# EAGLE design ControlBoard (EAGLE 8.3.2)
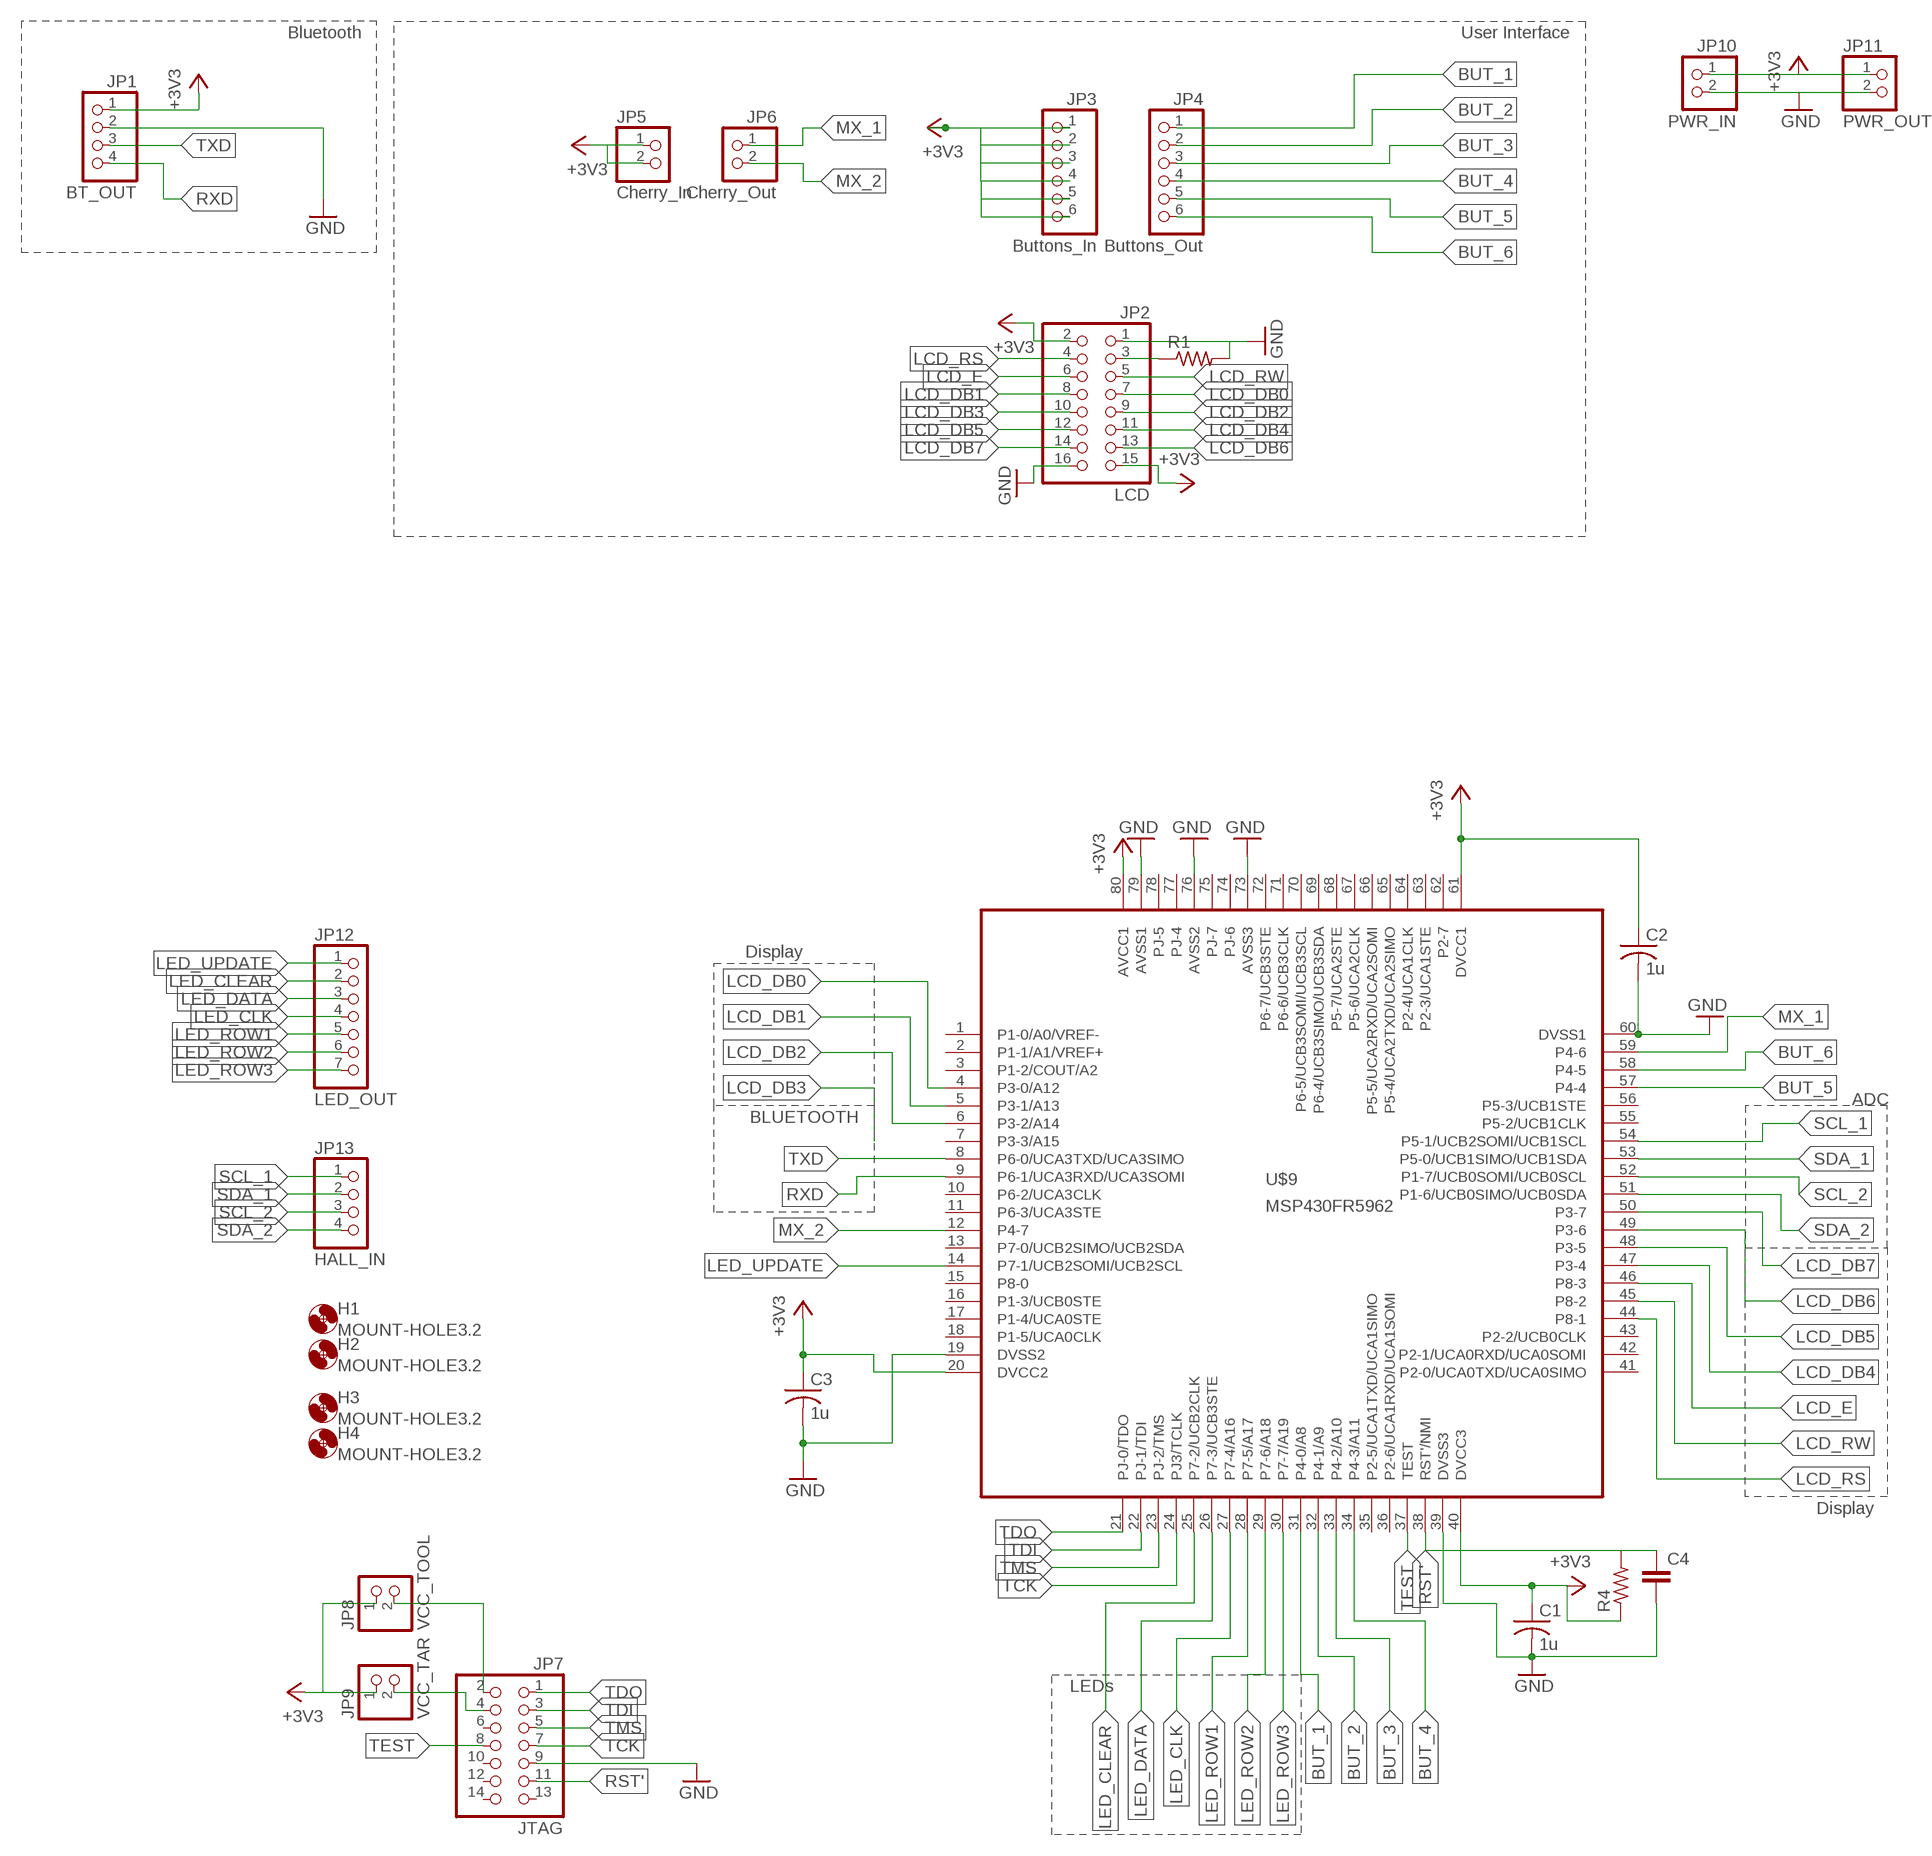
[diagram p0: schematic, sheet 1]

## Parts
C1  1u  C-USC0603  [C0603]
C2  1u  C-USC0603  [C0603]
C3  1u  C-USC0603  [C0603]
C4  C-EU025-025X050  [C025-025X050]
H1  MOUNT-HOLE3.2  [3,2]
H2  MOUNT-HOLE3.2  [3,2]
H3  MOUNT-HOLE3.2  [3,2]
H4  MOUNT-HOLE3.2  [3,2]
JP1  BT_OUT  PINHD-1X4  [1X04]
JP2  LCD  PINHD-2X8  [2X08]
JP3  Buttons_In  PINHD-1X6  [1X06]
JP4  Buttons_Out  PINHD-1X6  [1X06]
JP5  Cherry_In  PINHD-1X2  [1X02]
JP6  Cherry_Out  PINHD-1X2  [1X02]
JP7  JTAG  PINHD-2X7  [2X07]
JP8  VCC_TOOL  PINHD-1X2  [1X02]
JP9  VCC_TAR  PINHD-1X2  [1X02]
JP10  PWR_IN  PINHD-1X2  [1X02]
JP11  PWR_OUT  PINHD-1X2  [1X02]
JP12  LED_OUT  PINHD-1X7  [1X07]
JP13  HALL_IN  PINHD-1X4  [1X04]
R1  R-US_VMTA55  [VMTA55]
R4  R-US_VMTA55  [VMTA55]
U$9  MSP430FR5962  [LQFP80]

## Nets
+3V3: C1.1 C2.1 C3.1 JP1.1 JP2.2 JP2.15 JP3.1 JP3.2 JP3.3 JP3.4 JP3.5 JP3.6 JP5.1 JP5.2 JP8.1 JP9.1 JP10.1 JP11.1 R4.1 U$9.20(DVCC2) U$9.40(DVCC3) U$9.61(DVCC1) U$9.80(AVCC1)
BUT_1: JP4.1 U$9.31(P4-0/A8)
BUT_2: JP4.2 U$9.32(P4-1/A9)
BUT_3: JP4.3 U$9.33(P4-2/A10)
BUT_4: JP4.4 U$9.34(P4-3/A11)
BUT_5: JP4.5 U$9.57(P4-4)
BUT_6: JP4.6 U$9.58(P4-5)
GND: C1.2 C2.2 C3.2 C4.2 JP1.2 JP2.1 JP2.16 JP7.9 JP10.2 JP11.2 R1.2 U$9.19(DVSS2) U$9.39(DVSS3) U$9.60(DVSS1) U$9.73(AVSS3) U$9.76(AVSS2) U$9.79(AVSS1)
LCD_DB0: JP2.7 U$9.4(P3-0/A12)
LCD_DB1: JP2.8 U$9.5(P3-1/A13)
LCD_DB2: JP2.9 U$9.6(P3-2/A14)
LCD_DB3: JP2.10
LCD_DB4: JP2.11 U$9.47(P3-4)
LCD_DB5: JP2.12 U$9.48(P3-5)
LCD_DB6: JP2.13 U$9.49(P3-6)
LCD_DB7: JP2.14 U$9.50(P3-7)
LCD_E: JP2.6 U$9.46(P8-3)
LCD_RS: JP2.4 U$9.44(P8-1)
LCD_RW: JP2.5 U$9.45(P8-2)
LED_CLEAR: JP12.2 U$9.25(P7-2/UCB2CLK)
LED_CLK: JP12.4 U$9.27(P7-4/A16)
LED_DATA: JP12.3 U$9.26(P7-3/UCB3STE)
LED_ROW1: JP12.5 U$9.28(P7-5/A17)
LED_ROW2: JP12.6 U$9.29(P7-6/A18)
LED_ROW3: JP12.7 U$9.30(P7-7/A19)
LED_UPDATE: JP12.1 U$9.14(P7-1/UCB2SOMI/UCB2SCL)
MX_1: JP6.1 U$9.59(P4-6)
MX_2: JP6.2 U$9.12(P4-7)
N$3: JP2.3 R1.1
N$9: JP7.2 JP8.2
N$10: JP7.4 JP9.2
RST': C4.1 JP7.11 R4.2 U$9.38(RST'/NMI)
RXD: JP1.4 U$9.9(P6-1/UCA3RXD/UCA3SOMI)
SCL_1: JP13.1 U$9.54(P5-1/UCB2SOMI/UCB1SCL)
SCL_2: JP13.3 U$9.52(P1-7/UCB0SOMI/UCB0SCL)
SDA_1: JP13.2 U$9.53(P5-0/UCB1SIMO/UCB1SDA)
SDA_2: JP13.4 U$9.51(P1-6/UCB0SIMO/UCB0SDA)
TCK: JP7.7 U$9.24(PJ3/TCLK)
TDI: JP7.3 U$9.22(PJ-1/TDI)
TDO: JP7.1 U$9.21(PJ-0/TDO)
TEST: JP7.8 U$9.37(TEST)
TMS: JP7.5 U$9.23(PJ-2/TMS)
TXD: JP1.3 U$9.8(P6-0/UCA3TXD/UCA3SIMO)
Unconnected: JP7.6 JP7.10 JP7.12 JP7.13 JP7.14 U$9.2(P1-1/A1/VREF+) U$9.3(P1-2/COUT/A2) U$9.7(P3-3/A15) U$9.10(P6-2/UCA3CLK) U$9.11(P6-3/UCA3STE) U$9.13(P7-0/UCB2SIMO/UCB2SDA) U$9.15(P8-0) U$9.16(P1-3/UCB0STE) U$9.17(P1-4/UCA0STE) U$9.18(P1-5/UCA0CLK) U$9.35(P2-5/UCA1TXD/UCA1SIMO) U$9.36(P2-6/UCA1RXD/UCA1SOMI) U$9.41(P2-0/UCA0TXD/UCA0SIMO) U$9.42(P2-1/UCA0RXD/UCA0SOMI) U$9.43(P2-2/UCB0CLK) U$9.55(P5-2/UCB1CLK) U$9.56(P5-3/UCB1STE) U$9.62(P2-7) U$9.63(P2-3/UCA1STE) U$9.64(P2-4/UCA1CLK) U$9.65(P5-4/UCA2TXD/UCA2SIMO) U$9.66(P5-5/UCA2RXD/UCA2SOMI) U$9.67(P5-6/UCA2CLK) U$9.68(P5-7/UCA2STE) U$9.69(P6-4/UCB3SIMO/UCB3SDA) U$9.70(P6-5/UCB3SOMI/UCB3SCL) U$9.71(P6-6/UCB3CLK) U$9.72(P6-7/UCB3STE) U$9.74(PJ-6) U$9.75(PJ-7) U$9.77(PJ-4)

## Notes on the sheet
- Bluetooth | User Interface
- Display
- ADC
- BLUETOOTH
- Display
- LEDs

## Power pins joined to a net without a drawn wire
P1-0/A0/VREF-: U$9.1(P1-0/A0/VREF-)
PJ-5: U$9.78(PJ-5)

## Library data of the parts
C1-C3 = rcl:C-US: CAPACITOR, American symbol
C4 = rcl:C-EU: CAPACITOR, European symbol
H1-H4 = holes:MOUNT-HOLE: MOUNTING HOLE with drill center marker
JP1 JP13 = pinhead:PINHD-1X4: PIN HEADER
JP2 = pinhead:PINHD-2X8: PIN HEADER
JP3 JP4 = pinhead:PINHD-1X6: PIN HEADER
JP5 JP6 JP8-JP11 = pinhead:PINHD-1X2: PIN HEADER
JP7 = pinhead:PINHD-2X7: PIN HEADER
JP12 = pinhead:PINHD-1X7: PIN HEADER
R1 R4 = rcl:R-US_: RESISTOR, American symbol
U$9 = DesignReview:MSP430FR5962

## Board
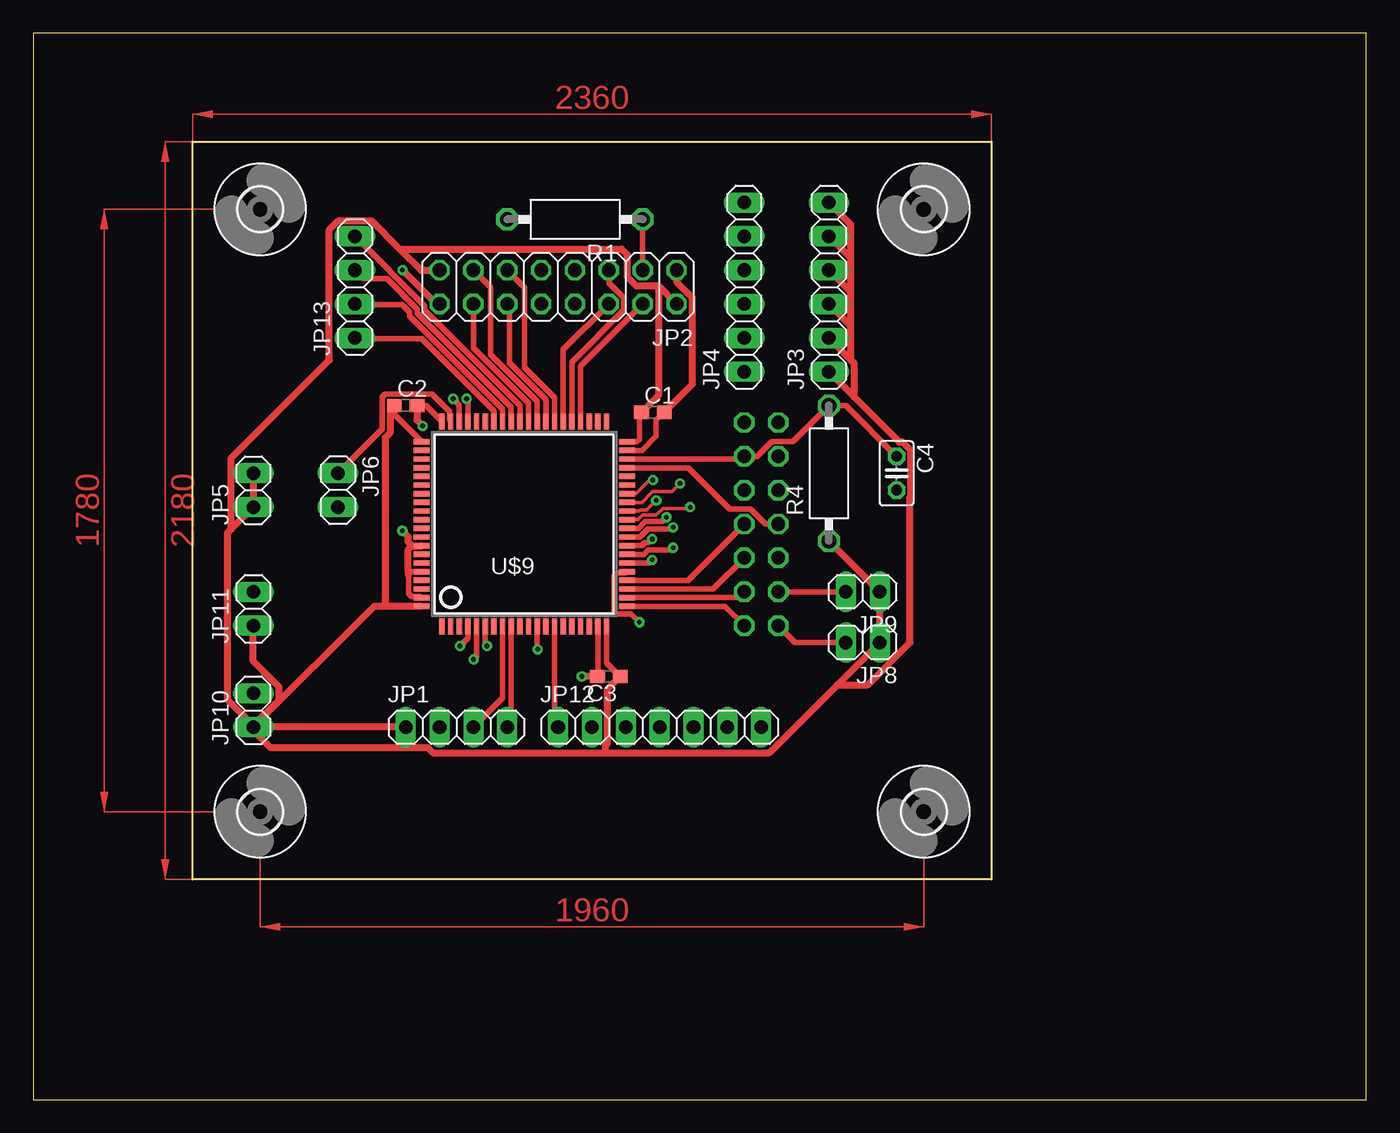
[diagram p1: board, top side]
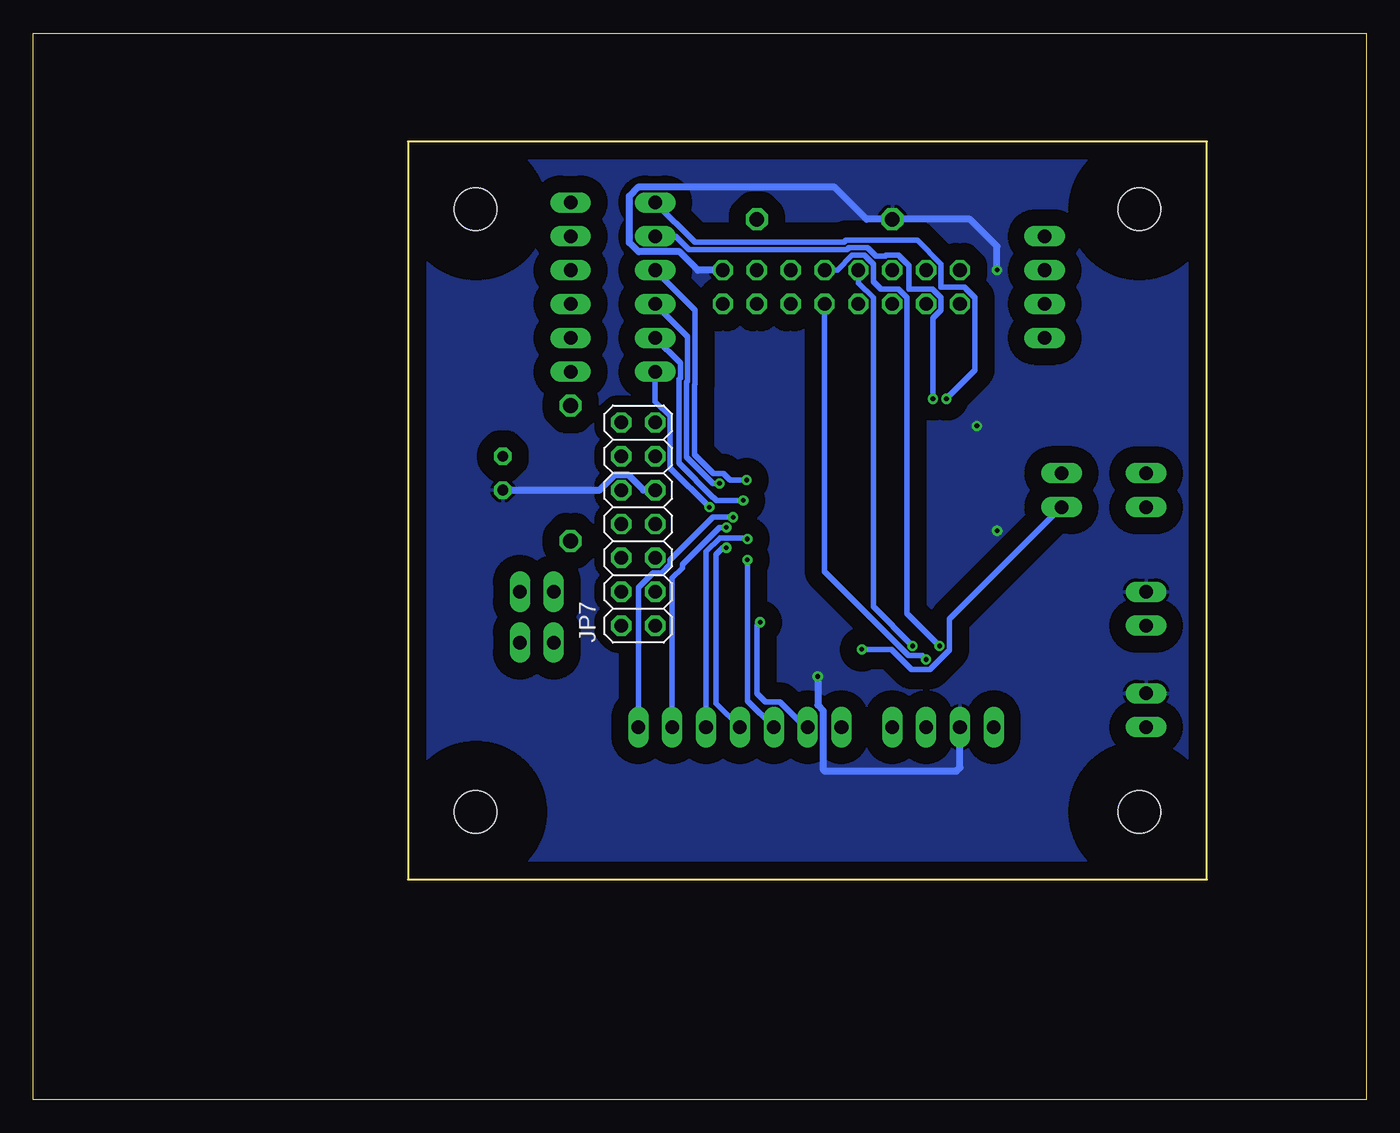
[diagram p2: board, bottom side, seen from below]

Size 100 x 80 mm. Coordinates in mm from the lower left corner, seen from the top.
Outline: 0,0 100,0 100,80 0,80 0,0
Outline: 11.94,71.88 71.88,71.88 71.88,16.51 11.94,16.51 11.94,71.88
Copper layers (1*16): Top 0.035mm / dielectric 1.5mm / Bottom 0.035mm
Design rules "default *": minimum track width 10mil, minimum drill 0.35mm, track to track 6mil, track to pad 6mil, pad to pad 6mil, via to via 6mil, smd to smd 6mil, copper to edge 40mil, drill to drill 6mil, minimum pad ring 10mil, minimum via ring 8mil, stop-mask expansion 4mil, vias tented up to drill 0mil, thermal gap 10mil

### Footprints (pad centres in the part's own frame; a part is rotated, then mirrored left to right if it is on the bottom)
C0603 = smd 1.1 x 1: 1 -0.85,0; 2 0.85,0
C025-025X050 = drill 0.813 octagon: 1 -1.27,0; 2 1.27,0
3,2 = hole 3.2: 0,0
1X04 = drill 1.016 long: 1 -3.81,0; 2 -1.27,0; 3 1.27,0; 4 3.81,0
2X08 = drill 1.016 octagon: 1 -8.89,-1.27; 2 -8.89,1.27; 3 -6.35,-1.27; 4 -6.35,1.27; 5 -3.81,-1.27; 6 -3.81,1.27; 7 -1.27,-1.27; 8 -1.27,1.27; 9 1.27,-1.27; 10 1.27,1.27; 11 3.81,-1.27; 12 3.81,1.27; 13 6.35,-1.27; 14 6.35,1.27; 15 8.89,-1.27; 16 8.89,1.27
1X06 = drill 1.016 long: 1 -6.35,0; 2 -3.81,0; 3 -1.27,0; 4 1.27,0; 5 3.81,0; 6 6.35,0
1X02 = drill 1.016 long: 1 -1.27,0; 2 1.27,0
2X07 = drill 1.016 octagon: 1 -7.62,-1.27; 2 -7.62,1.27; 3 -5.08,-1.27; 4 -5.08,1.27; 5 -2.54,-1.27; 6 -2.54,1.27; 7 0,-1.27; 8 0,1.27; 9 2.54,-1.27; 10 2.54,1.27; 11 5.08,-1.27; 12 5.08,1.27; 13 7.62,-1.27; 14 7.62,1.27
1X07 = drill 1.016 long: 1 -7.62,0; 2 -5.08,0; 3 -2.54,0; 4 0,0; 5 2.54,0; 6 5.08,0; 7 7.62,0
VMTA55 = drill 1.1 octagon: 1 -5.08,0; 2 5.08,0
LQFP80 = smd 0.4 x 1.2: 1 -6.175,-7.7; 2 -5.525,-7.7; 3 -4.875,-7.7; 4 -4.225,-7.7; 5 -3.575,-7.7; 6 -2.925,-7.7; 7 -2.275,-7.7; 8 -1.625,-7.7; 9 -0.975,-7.7; 10 -0.325,-7.7; 11 0.325,-7.7; 12 0.975,-7.7; 13 1.625,-7.7; 14 2.275,-7.7; 15 2.925,-7.7; 16 3.575,-7.7; 17 4.225,-7.7; 18 4.875,-7.7; 19 5.525,-7.7; 20 6.175,-7.7; 41 6.175,7.7; 42 5.525,7.7; 43 4.875,7.7; 44 4.225,7.7; 45 3.575,7.7; 46 2.925,7.7; 47 2.275,7.7; 48 1.625,7.7; 49 0.975,7.7; 50 0.325,7.7; 51 -0.325,7.7; 52 -0.975,7.7; 53 -1.625,7.7; 54 -2.275,7.7; 55 -2.925,7.7; 56 -3.575,7.7; 57 -4.225,7.7; 58 -4.875,7.7; 59 -5.525,7.7; 60 -6.175,7.7 | smd 1.2 x 0.4: 21 7.7,-6.175; 22 7.7,-5.525; 23 7.7,-4.875; 24 7.7,-4.225; 25 7.7,-3.575; 26 7.7,-2.925; 27 7.7,-2.275; 28 7.7,-1.625; 29 7.7,-0.975; 30 7.7,-0.325; 31 7.7,0.325; 32 7.7,0.975; 33 7.7,1.625; 34 7.7,2.275; 35 7.7,2.925; 36 7.7,3.575; 37 7.7,4.225; 38 7.7,4.875; 39 7.7,5.525; 40 7.7,6.175; 61 -7.7,6.175; 62 -7.7,5.525; 63 -7.7,4.875; 64 -7.7,4.225; 65 -7.7,3.575; 66 -7.7,2.925; 67 -7.7,2.275; 68 -7.7,1.625; 69 -7.7,0.975; 70 -7.7,0.325; 71 -7.7,-0.325; 72 -7.7,-0.975; 73 -7.7,-1.625; 74 -7.7,-2.275; 75 -7.7,-2.925; 76 -7.7,-3.575; 77 -7.7,-4.225; 78 -7.7,-4.875; 79 -7.7,-5.525; 80 -7.7,-6.175

### Placement (x,y rotation side)
C1  46.48,51.56 0 top
C2  27.94,52.07 0 top
C3  43.18,31.75 180 top
C4  64.77,46.99 270 top
H1  66.8,21.59 0 top
H2  17.02,66.8 0 top
H3  17.02,21.59 0 top
H4  66.8,66.8 0 top
JP1  31.75,27.94 0 top
JP2  39.37,60.96 180 top
JP3  59.69,60.96 90 top
JP4  53.34,60.96 90 top
JP5  16.51,45.72 90 top
JP6  22.86,45.72 270 top
JP7  54.61,43.18 90 bottom
JP8  62.23,34.29 180 top
JP9  62.23,38.1 180 top
JP10  16.51,29.21 90 top
JP11  16.51,36.83 90 top
JP12  46.99,27.94 0 top
JP13  24.13,60.96 90 top
R1  40.64,66.04 180 top
R4  59.69,46.99 90 top
U$9  36.83,43.18 0 top

### Tracks (layer width: path | path; a pad name or v marks a point on that pad's centre or on a via)
+3V3
  Top 0.406: U$9.20 43.01,32.77 C3.1 | C2.1 27.09,51.82 27.09,51.4 U$9.61 | U$9.40 45.29,49.35 45.47,49.53 45.47,51.4 C1.1
  Top 0.508: R4.1 JP9.1 JP8.1 60.33,31.11 | U$9.80 26.42,37.01 | 26.42,37.01 25.57,37.01 JP10.1 | JP1.1 JP10.1 | JP10.1 16.51,28.07 | JP11.1 16.51,32.89 18.44,30.96 18.44,30 16.51,28.07 | JP10.1 16.51,28.07 | 16.51,28.07 14.58,30 14.58,42.52 14.86,42.8 | 14.86,42.8 JP5.1 JP5.2 | JP10.1 16.51,27.69 17.78,26.42 29.59,26.42 30,26.01 42.93,26.01 | 42.93,26.01 55.22,26.01 60.33,31.11 | 42.93,26.01 42.93,26.54 43.08,26.69 43.08,30.8 C3.1 | 26.42,37.01 26.42,49.68 26.79,50.06 26.79,51.52 27.09,51.82 | 14.86,42.8 14.86,48.13 22.2,55.47 22.2,65.25 22.88,65.94 25.38,65.94 27.5,63.82 | JP2.15 29.08,62.23 27.5,63.82 | 60.33,31.11 62.61,31.11 65.79,34.29 65.79,45.23 65.84,45.28 65.84,48.7 65.21,49.33 64.97,49.33 61.59,52.7 | 61.59,52.7 JP3.1 | 61.59,52.7 61.59,55.24 61.34,55.5 | 61.34,55.5 JP3.2 | 61.34,55.5 61.34,58.04 | 61.34,58.04 JP3.3 | 61.34,58.04 61.34,60.58 | 61.34,60.58 JP3.4 | 61.34,60.58 61.34,63.12 | 61.34,63.12 JP3.5 | 61.34,63.12 61.34,65.66 JP3.6 | 27.5,63.82 44.13,63.82 44.55,63.4 44.55,61.75 45.24,61.06 46.89,61.06 | JP2.2 46.89,61.06 | 46.89,61.06 46.89,52.82 C1.1
BUT_1  (via drill 0.35)
  Top 0.254: U$9.31 45.36,43.51 45.69,43.84 46.72,43.84 47.23,44.35 49.17,44.35 v49.28,44.45
  Top 0.406: v49.28,44.45 49.25,44.42
  Bottom 0.406: JP4.1 53.34,52.38 52.22,51.26 52.22,47.4 v49.28,44.45
BUT_2  (via drill 0.35)
  Top 0.254: U$9.32 45.43,44.16 45.52,44.24 46.02,44.24 v46.74,44.96
  Bottom 0.406: v46.74,44.96 48.75,44.96 48.97,45.18 48.99,45.18 51.56,47.75 51.56,54.05 51.46,54.15 51.46,55.27 JP4.2
BUT_3  (via drill 0.35)
  Top 0.254: U$9.33 45.65,44.8 46.4,45.55 | 46.4,45.55 46.46,45.62 | 46.4,45.55 46.46,45.62 | v48.51,46.23 47.9,45.62 46.46,45.62
  Bottom 0.406: v48.51,46.23 49.02,46.23 51,48.21 51,53.81 50.9,53.92 50.9,57.25 JP4.3
BUT_4  (via drill 0.35)
  Top 0.254: U$9.34 45.2,45.45 46.23,46.48 v46.48,46.48
  Bottom 0.406: JP4.4 50.34,59.23 50.34,53.68 50.41,53.62 50.41,48.4 48.97,46.96 48.21,46.96 47.73,46.48 v46.48,46.48
BUT_5  (via drill 0.35)
  Top 0.406: U$9.57 32.6,52.48 v32.51,52.58
  Bottom 0.406: JP4.5 51.82,64.77 50.8,63.75 38.95,63.75 38.79,63.91 37.41,63.91 36.79,63.29 36.08,63.29 36.02,63.35 35.1,63.35 34.31,62.56 34.31,60.81 32.56,60.81 31.9,60.15 31.9,59.23 32.51,58.62 v32.51,52.58
BUT_6  (via drill 0.35)
  Top 0.406: U$9.58 31.95,52.1 31.78,52.27 31.78,52.3 v31.5,52.58
  Bottom 0.406: v31.5,52.58 31.5,52.6 29.36,54.73 29.36,60.15 30.15,60.94 31.9,60.94 31.9,62.69 33.67,64.47 39.03,64.47 39.18,64.31 50.34,64.31 JP4.6
GND  (via drill 0.35)
  Top 0.406: U$9.19 42.35,31.77 C3.2 | C2.2 29.46,52.07 U$9.60 | 44.55,48.68 U$9.39 45.66,48.7 46.74,49.78 46.74,50.97 C1.2 | 28.12,39.32 28.17,39.27 28.17,37.96 28.38,37.75 29.04,37.75 U$9.79 | U$9.76 28.14,39.6 28.12,39.62
  Top 0.508: JP2.1 48.26,61.34 49.43,60.17 49.43,53.66 C1.2 | JP2.16 30.25,59.69 v27.7,62.24 | C2.2 28.79,50.97 v29.21,50.55 | C3.2 v41.15,31.75 | 28.36,41.51 28.12,41.27 28.12,39.62 28.12,39.32 | U$9.73 29.09,41.51 28.36,41.51 | 28.36,41.51 28.36,41.6 28.12,41.84 28.12,42.23 v27.69,42.67
  Bottom 0.508: C4.2 57.53,45.72 56.36,46.89 55.4,46.89 54.23,45.72 JP7.9 | JP2.1 50.14,62.23 51.51,63.6 54.59,63.6 55.27,64.29 55.27,67.79 54.59,68.48 39.93,68.48 37.49,66.04 R1.2 29.72,66.04 27.7,64.02 v27.7,62.24 | v41.15,31.75 41.15,29.59 40.74,29.19 40.74,24.74 40.64,24.64 30.73,24.64 30.48,24.89 JP1.2
  pour Bottom (isolate 1.27): 12.19,71.63 71.63,71.63 71.63,16.76 12.19,16.76
LCD_DB0  (via drill 0.35)
  Top 0.406: U$9.4 32.6,34.64 v32,34.04
  Bottom 0.406: JP2.7 39.68,62.23 38.56,63.35 37.64,63.35 36.98,62.69 36.98,61.37 36.42,60.81 35.1,60.81 34.44,60.15 34.44,36.47 v32,34.04
LCD_DB1  (via drill 0.35)
  Top 0.406: U$9.5 33.26,33.26 v33.02,33.02
  Bottom 0.406: v33.02,33.02 33.3,33.3 34.34,33.3 40.64,39.6 JP2.8
LCD_DB2  (via drill 0.35)
  Top 0.406: U$9.6 33.91,34.17 v34.04,34.04
  Bottom 0.406: JP2.9 38.1,61.27 36.98,60.15 36.98,36.98 v34.04,34.04
LCD_DB4
  Top 0.406: U$9.47 39.1,52.67 36.87,54.91 36.87,60.92 JP2.11
LCD_DB5
  Top 0.406: U$9.48 38.45,52.53 35.72,55.27 35.72,59.53 JP2.12
LCD_DB6
  Top 0.406: U$9.49 37.8,52.39 34.3,55.89 34.3,60.95 JP2.13
LCD_DB7
  Top 0.406: U$9.50 37.16,52.25 33.02,56.39 JP2.14
LCD_E
  Top 0.406: U$9.46 39.76,56.27 JP2.6
LCD_RS
  Top 0.406: U$9.44 41.05,55.02 JP2.4
LCD_RW
  Top 0.406: U$9.45 40.41,55.33 44.3,59.23 44.3,60.15 43.18,61.27 JP2.5
LED_CLEAR  (via drill 0.35)
  Top 0.406: U$9.25 44.44,39.51 43.79,39.51 43.57,39.3 43.57,36.66 43.79,36.45 44.83,36.45 v45.47,35.81
  Bottom 0.406: v45.47,35.81 45.72,35.56 45.72,30.48 45.06,29.82 43.99,29.82 42.11,27.94 JP12.2
LED_CLK  (via drill 0.35)
  Top 0.406: U$9.27 45.81,40.91 46.13,41.22 47.83,41.22 v48.01,41.4
  Bottom 0.406: v48.01,41.4 48.26,41.4 48.77,40.89 48.77,29.72 JP12.4
LED_DATA  (via drill 0.35)
  Top 0.406: U$9.26 46.2,40.26 v46.43,40.49
  Bottom 0.406: v46.43,40.49 46.43,29.92 JP12.3
LED_ROW1  (via drill 0.35)
  Top 0.406: U$9.28 45.67,41.55 45.9,41.78 46.15,41.78 v46.43,42.06
  Bottom 0.406: JP12.5 49.53,41.12 48.5,42.15 46.52,42.15 v46.43,42.06
LED_ROW2  (via drill 0.35)
  Top 0.406: U$9.29 45.53,42.2 46.12,42.8 47.88,42.8 v48.01,42.93
  Bottom 0.406: v48.01,42.93 48.51,42.93 51.31,40.13 51.31,39.88 52.07,39.12 JP12.6
LED_ROW3  (via drill 0.35)
  Top 0.406: U$9.30 45.39,42.85 45.89,43.35 47.16,43.35 v47.5,43.69
  Bottom 0.406: JP12.7 54.61,38.41 53.5,39.52 52.88,39.52 52.22,40.18 52.22,40.49 49.02,43.69 v47.5,43.69
LED_UPDATE
  Top 0.406: U$9.14 39.1,28.2 JP12.1
MX_1
  Top 0.406: JP6.1 26.18,50.31 26.18,52.72 26.39,52.93 29.91,52.93 31.21,51.62 31.21,50.97 U$9.59
MX_2  (via drill 0.35)
  Top 0.406: U$9.12 37.8,33.82 v37.85,33.78
  Bottom 0.406: v37.85,33.78 35.61,33.78 34.11,32.29 32.72,32.29 31.27,33.73 31.27,36.04 JP6.2
N$3
  Top 0.406: R1.1 JP2.3
N$9
  Top 0.406: JP8.2 57.15,34.29 JP7.2
N$10
  Top 0.406: JP9.2 JP7.4
RST'
  Top 0.406: C4.1 60.96,52.07 R4.2 57,49.38 55.42,49.38 54.3,48.26 JP7.11 53.13,48.05 U$9.38
RXD
  Top 0.406: U$9.9 35.85,28.23 JP1.4
SCL_1
  Top 0.406: U$9.54 34.55,51.66 29.14,57.08 24.2,57.08 JP13.1
SCL_2
  Top 0.406: U$9.52 35.85,51.94 28.8,59 28.8,59.31 26.53,61.58 24.78,61.58 JP13.3
SDA_1
  Top 0.406: U$9.53 35.2,51.8 28.25,58.76 28.25,59.08 27.66,59.66 24.16,59.66 JP13.2
SDA_2
  Top 0.406: JP13.4 29.36,59.54 29.36,59.23 36.51,52.08 U$9.51
TCK
  Top 0.406: U$9.24 49.12,38.95 JP7.7
TDI
  Top 0.406: U$9.22 52.9,37.66 JP7.3
TDO
  Top 0.406: U$9.21 51.9,37.01 JP7.1
TEST
  Top 0.406: JP7.8 54.92,43.18 53.8,44.3 52.22,44.3 49.15,47.37 44.56,47.37 U$9.37
TMS
  Top 0.406: U$9.23 51.01,38.3 JP7.5
TXD
  Top 0.406: U$9.8 35.2,30.12 JP1.3
(copper drawn outside any net)
  shapes: Top area x4